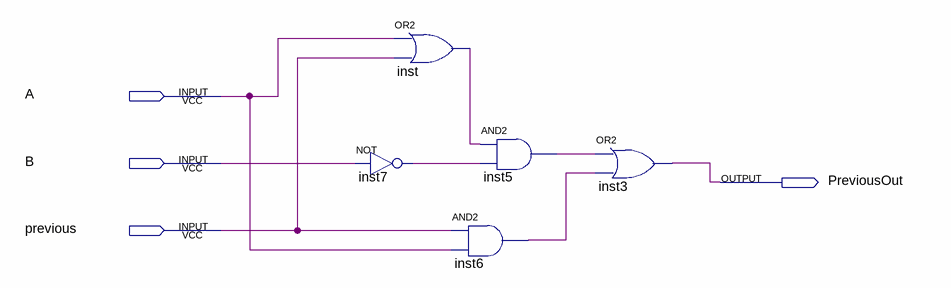
[diagram p0: schematic sheet]
// Quartus schematic MaiorQ1bit.bdf as structural Verilog: 5 symbols, 4 pins
module MaiorQ1bit (
  input  A,
  input  B,
  input  previous,
  output PreviousOut
);

  wire inst5_out, inst6_out, inst7_out, inst_out;

  or inst (inst_out, A, previous);
  not inst7 (inst7_out, B);
  and inst5 (inst5_out, inst_out, inst7_out);
  and inst6 (inst6_out, previous, A);
  or inst3 (PreviousOut, inst5_out, inst6_out);
endmodule
